# Altium schematic sheet Output_schematic.SchDoc
size A3
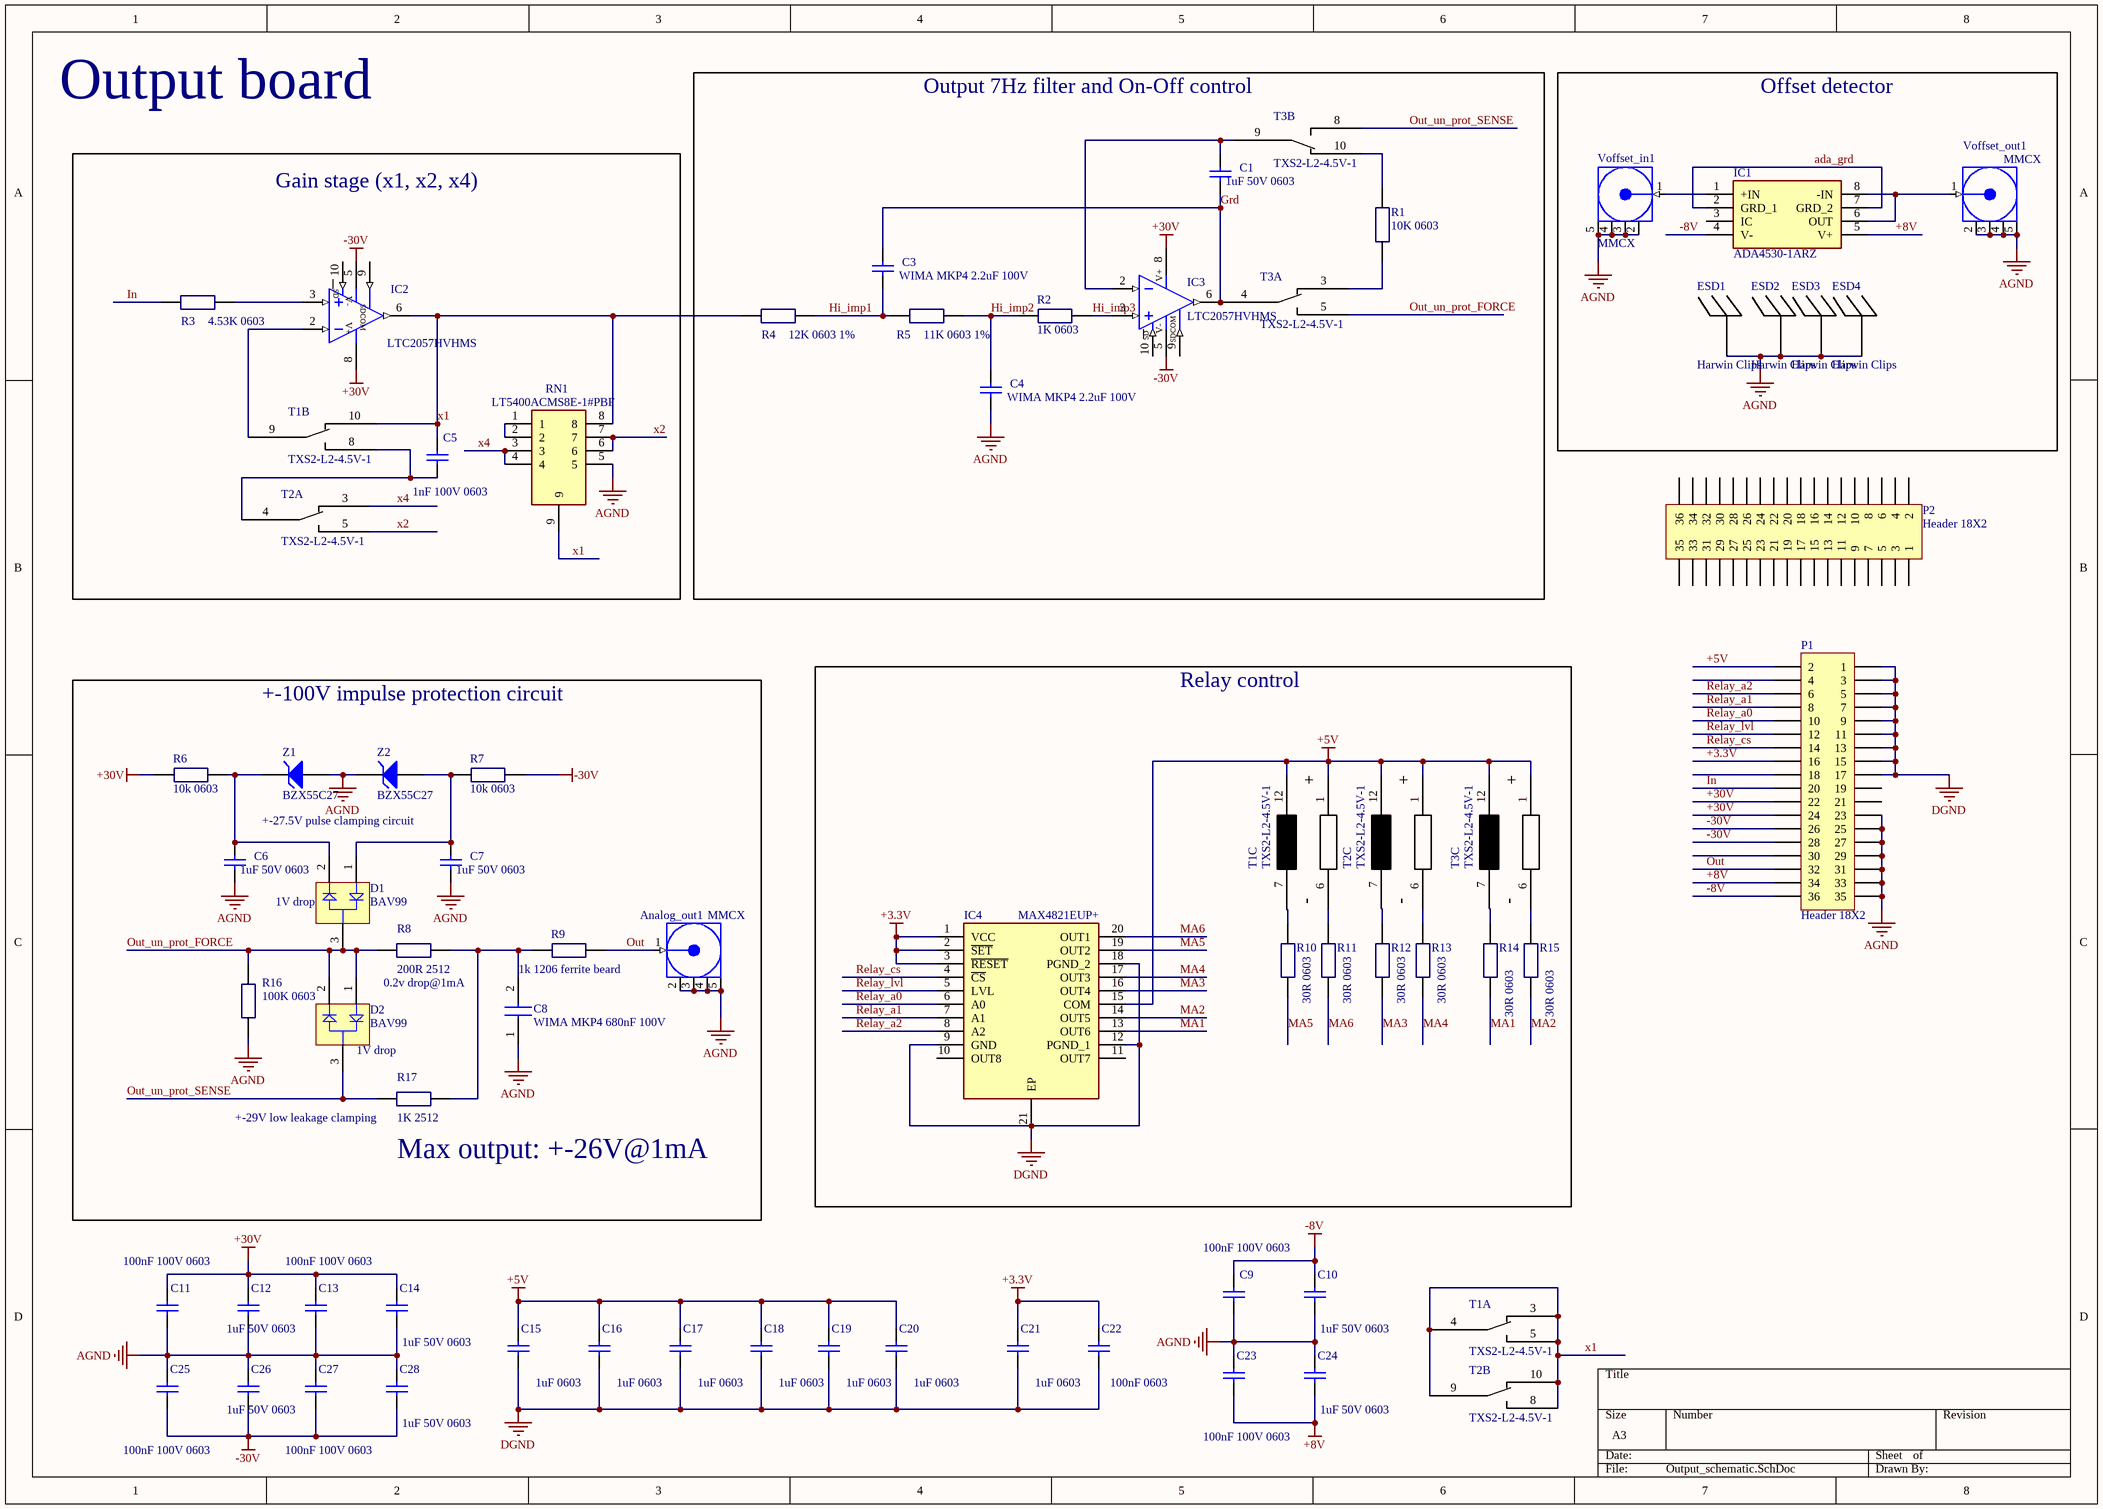
[diagram p0: Output_schematic.SchDoc]

## Parts
Analog_out1  MMCX  [MMCX2.54-V5]
C1  1uF 50V 0603  [CAP 0603]
C3  WIMA MKP4 2.2uF 100V  [90g WIMA MKP4 2.2uF 100V]
C4  WIMA MKP4 2.2uF 100V  [90g WIMA MKP4 2.2uF 100V]
C5  1nF 100V 0603  [CAP 0603]
C6  1uF 50V 0603  [CAP 0603]
C7  1uF 50V 0603  [CAP 0603]
C8  WIMA MKP4 680nF 100V  [MKP4F036804F00KSSD]
C9  100nF 100V 0603  [CAP 0603]
C10  1uF 50V 0603  [CAP 0603]
C11  100nF 100V 0603  [CAP 0603]
C12  1uF 50V 0603  [CAP 0603]
C13  100nF 100V 0603  [CAP 0603]
C14  1uF 50V 0603  [CAP 0603]
C15  1uF 0603  [CAP 0603]
C16  1uF 0603  [CAP 0603]
C17  1uF 0603  [CAP 0603]
C18  1uF 0603  [CAP 0603]
C19  1uF 0603  [CAP 0603]
C20  1uF 0603  [CAP 0603]
C21  1uF 0603  [CAP 0603]
C22  100nF 0603  [CAP 0603]
C23  100nF 100V 0603  [CAP 0603]
C24  1uF 50V 0603  [CAP 0603]
C25  100nF 100V 0603  [CAP 0603]
C26  1uF 50V 0603  [CAP 0603]
C27  100nF 100V 0603  [CAP 0603]
C28  1uF 50V 0603  [CAP 0603]
D1  BAV99  [INF-SOT23_N]
D2  BAV99  [INF-SOT23_N]
ESD1  Harwin Clips  [HARWIN - S0981-46R - CLIP]
ESD2  Harwin Clips  [HARWIN - S0981-46R - CLIP]
ESD3  Harwin Clips  [HARWIN - S0981-46R - CLIP]
ESD4  Harwin Clips  [HARWIN - S0981-46R - CLIP]
IC1  ADA4530-1ARZ  [SOIC127P600X175-8N]
IC2  LTC2057HVHMS  [LT-MS-10_M]
IC3  LTC2057HVHMS  [LT-MS-10_M]
IC4  MAX4821EUP+  [SOP65P638X110-21N]
P1  Header 18X2  [HDR2X18]
P2  Header 18X2  [HDR2X18]
R1  10K 0603  [1608[0603]]
R2  1K 0603  [1608[0603]]
R3  4.53K 0603  [1608[0603]]
R4  12K 0603 1%  [1608[0603]]
R5  11K 0603 1%  [1608[0603]]
R6  10k 0603  [1608[0603]]
R7  10k 0603  [1608[0603]]
R8  200R 2512  [CRCW2512]
R9  1k 1206 ferrite beard  [Yageo HV 1206]
R10  30R 0603  [1608[0603]]
R11  30R 0603  [1608[0603]]
R12  30R 0603  [1608[0603]]
R13  30R 0603  [1608[0603]]
R14  30R 0603  [1608[0603]]
R15  30R 0603  [1608[0603]]
R16  100K 0603  [1608[0603]_RES]
R17  1K 2512  [CRCW2512]
RN1  LT5400ACMS8E-1#PBF  [SOP65P490X110-9N]
T1  TXS2-L2-4.5V-1  [TXS2-L2-4.5V-1]  (parts A,B,C of 3)
T2  TXS2-L2-4.5V-1  [TXS2-L2-4.5V-1]  (parts A,B,C of 3)
T3  TXS2-L2-4.5V-1  [TXS2-L2-4.5V-1]  (parts A,B,C of 3)
Voffset_in1  MMCX  [MMCX2.54-V5]
Voffset_out1  MMCX  [MMCX2.54-V5]
Z1  BZX55C27  [DO-35]
Z2  BZX55C27  [DO-35]

## Blocks framed on the sheet
Output 7Hz filter and On-Off control: C1 C3 C4 IC3 R1 R2 R4 R5 T3
Offset detector: ESD1-ESD4 IC1 Voffset_in1 Voffset_out1
Gain stage (x1, x2, x4): C5 IC2 R3 RN1 T1 T2
Relay control: IC4 R10-R15 T1-T3
Max output: +-26V@1mA: Analog_out1 C6-C8 D1 D2 R6-R9 R16 R17 Z1 Z2

## Nets
+3.3V: C21.1 C22.1 IC4.1(VCC) IC4.2(~{SET}) IC4.3(~{RESET}) P1.16
+5V: C15.1 C16.1 C17.1 C18.1 C19.1 C20.1 IC4.15(COM) P1.2 T1.1 T1.12 T2.1 T2.12 T3.1 T3.12
+8V: C23.2 C24.2 IC1.5(V+) P1.34
+30V: C11.1 C12.1 C13.1 C14.1 IC2.8(V+) IC3.8(V+) P1.22 P1.24 R6.1(A)
-8V: C9.1 C10.1 IC1.4(V-) P1.36
-30V: C25.2 C26.2 C27.2 C28.2 IC2.5(V-) IC3.5(V-) P1.26 P1.28 R7.2
AGND: Analog_out1.2(GND) Analog_out1.3(GND) Analog_out1.4(GND) Analog_out1.5(GND) C4.2 C6.2 C7.2 C8.1 C9.2 C10.2 C11.2 C12.2 C13.2 C14.2 C23.1 C24.1 C25.1 C26.1 C27.1 C28.1 ESD1.1 ESD2.1 ESD3.1 ESD4.1 P1.23 P1.25 P1.27 P1.29 P1.31 P1.33 P1.35 R16.2 RN1.5 Voffset_in1.2(GND) Voffset_in1.3(GND) Voffset_in1.4(GND) Voffset_in1.5(GND) Voffset_out1.2(GND) Voffset_out1.3(GND) Voffset_out1.4(GND) Voffset_out1.5(GND) Z1.1(A) Z2.2(K)
DGND: C15.2 C16.2 C17.2 C18.2 C19.2 C20.2 C21.2 C22.2 IC4.9(GND) IC4.12(PGND_1) IC4.18(PGND_2) IC4.21(EP) P1.1 P1.3 P1.5 P1.7 P1.9 P1.11 P1.13 P1.15 P1.17
ada_grd: IC1.2(GRD_1) IC1.7(GRD_2)
Grd: C1.2 C3.1 IC3.6(OUT) T3.4
Hi_imp1: C3.2 R4.1(A) R5.2
Hi_imp2: C4.1 R2.1(A) R5.1(A)
Hi_imp3: IC3.3(IN+) R2.2
In: P1.20 R3.2
MA1: IC4.13(OUT6) R14.2
MA2: IC4.14(OUT5) R15.2
MA3: IC4.16(OUT4) R12.2
MA4: IC4.17(OUT3) R13.2
MA5: IC4.19(OUT2) R10.2
MA6: IC4.20(OUT1) R11.2
Out: Analog_out1.1(Signal) P1.32 R9.2
Out_un_prot_FORCE: D1.3(C) D2.1(A1) D2.2(K2) R8.2 R16.1(A) T3.5
Out_un_prot_SENSE: D2.3(C) R17.2 T3.8
Relay_a0: IC4.6(A0) P1.10
Relay_a1: IC4.7(A1) P1.8
Relay_a2: IC4.8(A2) P1.6
Relay_cs: IC4.4(~{CS}) P1.14
Relay_lvl: IC4.5(LVL) P1.12
x1: C5.1 IC2.6(OUT) R4.2 RN1.8 RN1.9 T1.3 T1.4 T1.5 T1.10 T2.8 T2.9 T2.10
x2: RN1.6 RN1.7 T2.5
x4: RN1.3 RN1.4 T2.3
NetC1_1: C1.1 IC3.2(IN-) T3.9
NetC5_2: C5.2 T1.8 T2.4
NetC6_1: C6.1 D1.2(K2) R6.2 Z1.2(K)
NetC7_1: C7.1 D1.1(A1) R7.1(A) Z2.1(A)
NetC8_2: C8.2 R8.1(A) R9.1(A) R17.1(A)
NetIC1_1: IC1.1(+IN) Voffset_in1.1(Signal)
NetIC1_6: IC1.6(OUT) IC1.8(-IN) Voffset_out1.1(Signal)
NetIC2_2: IC2.2(IN-) T1.9
NetIC2_3: IC2.3(IN+) R3.1(A)
NetR1_1: R1.1(A) T3.3
NetR1_2: R1.2 T3.10
NetR10_1: R10.1(A) T1.7
NetR11_1: R11.1(A) T1.6
NetR12_1: R12.1(A) T2.7
NetR13_1: R13.1(A) T2.6
NetR14_1: R14.1(A) T3.7
NetR15_1: R15.1(A) T3.6
NetRN1_1: RN1.1 RN1.2

Not connected (* = marked no-connect by the designer): IC1 3(IC); IC2 9(SDCOM) 10(~{SD}); IC3 9(SDCOM) 10(~{SD}); IC4 10(OUT8) 11(OUT7); P1 4 18 19 21 30; P2 1 2 3 4 5 6 7 8 9 10 11 12 13 14 15 16 17 18 19 20 21 22 23 24 25 26 27 28 29 30 31 32 33 34 35 36

## Notes on the sheet
- Output board
- +-100V impulse protection circuit
- +-27.5V pulse clamping circuit
- (near D1) 1V drop
- 0.2v drop@1mA
- (near D2) 1V drop
- (near R17) +-29V low leakage clamping
- (in symbol LTC2057xHMS) SD
- (in symbol TXS2-L2-4.5V-1, part C) +; -

## Library data of the parts
Analog_out1 Voffset_in1 Voffset_out1 = COAX-M: RF Coaxial PCB Connector, MMCX; Thru-Hole, Vertical Mount Plug,  50 Ohm Impedance; PackageDocument: Rev. A, 16-Jun-1997; PCB_Layout: Complies with manufacturer's recommendation.; DrillSize: Corresponds to nominal value.; Published: 15-Jul-2004; LatestRevisionDate: 15-Jul-2004; LatestRevisionNote: Component Replaced.; DatasheetDocument: 30-May-2003; PackageReference: 908-21103; Publisher: Altium Limited; ComponentLink1Description: Manufacturer Link; ComponentLink1URL: http://www.amphenolrf.com/
C1 C3-C7 C9-C28 = CC1206_1UF_25V_10%_X7R: Non-polarised capacitor; Part Description: SMD Multilayer Chip Ceramic Capacitor; Manufacturer: GENERIC; Manufacturer1 Part Number: C1206C105K3RAC; Voltage: 25V; TC: X7R; Tolerance: ±10%; Part Number: CC1206_1UF_25V_10%_X7R; Component Kind: Standard; Component Type: Standard; Footprint: CAPC3216X140N; Pin Count: 2; Status: Preferred; Manufacturer Part Number: CC1206_1UF_25V_10%_X7R; Case: 1206; Mounted: Yes; Socket: No; SMD: Yes; Sense: No; Manufacturer1 Example: KEMET; Manufacturer1 ComponentHeight: 1.75mm; HelpURL: \\cern.ch\dfs\Applications\Altium\Datasheets\CC1206_X7R_KEMET.pdf; Author: CERN DEM JLC; CreateDate: 03.12.2007; LatestRevisionDate: 03.12.2007
  C1 C6 C7 C10 C12 C14 C24 C26 C28: Value: 1uF 50V 0603
  C3 C4: Value: WIMA MKP4 2.2uF 100V
  C5: Value: 1nF 100V 0603
  C9 C11 C13 C23 C25 C27: Value: 100nF 100V 0603
  C15-C21: Value: 1uF 0603
  C22: Value: 100nF 0603
C8 = MKP4F036804F00KSSD: Capacitor; Datasheet Link: https://componentsearchengine.com/Datasheets/1/MKP4F036804F00KSSD.pdf; Height: 15mm; Manufacturer_Name: WIMA; Manufacturer_Part_Number: MKP4F036804F00KSSD; Mouser Part Number: 505-MKP4F036804F00KS; Mouser Price/Stock: https://www.mouser.co.uk/ProductDetail/WIMA/MKP4F036804F00KSSD?qs=7N384g6sXM%2Ff4ZVcxZrvpg%3D%3D; Arrow Part Number: MKP4F036804F00KSSD; Arrow Price/Stock: https://www.arrow.com/en/products/mkp4f036804f00kssd/wima
D1 D2 = BAV99: Silicon Switching Diode, SOT23, Reel, Green; Manufacturer: Infineon; Green: TRUE; PackageVersion: Apr-08; PackageReference: SOT23; PackageDescription: 3-Pin Small Outline Transistor Package, 1.3 x 2.9 mm Body, 0.95 mm Pitch; Supplier 1: Arrow; Supplier Part Number 1: 8_hDx09NysxyY_EZJdaSbs5L1p9U5ut-2MaZMQWGOaA; Supplier 2: Farnell; Supplier Part Number 2: 1056504RL; Supplier 3: Farnell; Supplier Part Number 3: 1056504; Packing: Reel; Mounting Technology: Surface Mount; PartNumber: BAV99; ComponentLink1Description: Manufacturer URL; ComponentLink1URL: http://www.infineon.com/; ComponentLink2Description: Datasheet; ComponentLink2URL: http://www.infineon.com/dgdl/bav99series.pdf?folderId=db3a30431400ef6801141b5844e103ea&fileId=db3a30431400ef6801141c1b237d042f; ComponentLink3Description: Package Specification; ComponentLink3URL: http://www.infineon.com/dgdl/smbta14_mmbta14.pdf?folderId=db3a30431441fb5d011445c30f210183&fileId=db3a30431441fb5d011445ef0201018c
ESD1-ESD4 = Harwin Clips: Order: S0981-46R
IC1 = ADA4530-1ARZ: Integrated Circuit; Manufacturer_Name: Analog Devices; Datasheet Link: http://www.analog.com/media/en/technical-documentation/data-sheets/ADA4530-1.pdf; Height: 1.75mm; Manufacturer_Part_Number: ADA4530-1ARZ; Mouser Part Number: 584-ADA4530-1ARZ; Mouser Price/Stock: https://www.mouser.co.uk/ProductDetail/Analog-Devices/ADA4530-1ARZ?qs=JeIcUl65ClBv6gT9eb3ViA%3D%3D; Arrow Part Number: ADA4530-1ARZ; Arrow Price/Stock: https://www.arrow.com/en/products/ada4530-1arz/analog-devices?region=nac
IC2 IC3 = LTC2057xHMS: High Voltage, Low Noise, Zero-Drift Operational  Amplifier; Device: LTC2057HVHMS
IC4 = MAX4821EUP+: Integrated Circuit; Manufacturer_Name: Maxim Integrated; Datasheet Link: https://datasheets.maximintegrated.com/en/ds/MAX4820-MAX4821.pdf; Height: 1.1mm; Manufacturer_Part_Number: MAX4821EUP+; Mouser Part Number: 700-MAX4821EUP; Mouser Price/Stock: https://www.mouser.co.uk/ProductDetail/Maxim-Integrated/MAX4821EUP%2b?qs=1THa7WoU59EDqrTeBvjo%2FQ%3D%3D
P1 P2 = Header 18X2: Header, 18-Pin, Dual row; System: Connector; LatestRevisionDate: 17-Jul-2002; LatestRevisionNote: Re-released for DXP Platform.; Publisher: Altium Limited
R1-R17 = Resistor 0805: Order: ERA-3AEB49R9V; Avail: 20
  R1: Value: 10K 0603
  R2: Value: 1K 0603
  R3: Value: 4.53K 0603
  R4: Value: 12K 0603 1%
  R5: Value: 11K 0603 1%
  R6 R7: Value: 10k 0603
  R8: Value: 200R 2512
  R9: Value: 1k 1206 ferrite beard
  R10-R15: Value: 30R 0603
  R16: Value: 100K 0603
  R17: Value: 1K 2512
RN1 = LT5400ACMS8E-1#PBF: Resistor Network; Manufacturer_Name: Analog Devices; Datasheet Link: https://www.analog.com/media/en/technical-documentation/data-sheets/5400fc.pdf; Height: 1.1mm; Manufacturer_Part_Number: LT5400ACMS8E-1#PBF; Mouser Part Number: 584-5400ACMS8E-1PBF; Mouser Price/Stock: https://www.mouser.com/Search/Refine.aspx?Keyword=584-5400ACMS8E-1PBF; Arrow Part Number: LT5400ACMS8E-1#PBF; Arrow Price/Stock: https://www.arrow.com/en/products/lt5400acms8e-1pbf/analog-devices
Z1 Z2 = BZX55C27: Silicon Epitaxial Planar Zener Diode (0.3 to 0.5W); Published: 8-Jun-2000; LatestRevisionDate: 17-Jul-2002; LatestRevisionNote: Re-released for DXP Platform.; DatasheetDocument: 1-Apr-1999; PackageReference: DO-35; Publisher: Altium Limited; Code_JEDEC: DO-204-AH; ComponentLink1Description: Manufacturer Link; ComponentLink1URL: http://www.vishay.com/; ComponentLink2Description: Datasheet; ComponentLink2URL: http://www.vishay.com/docs/85604/85604.pdf